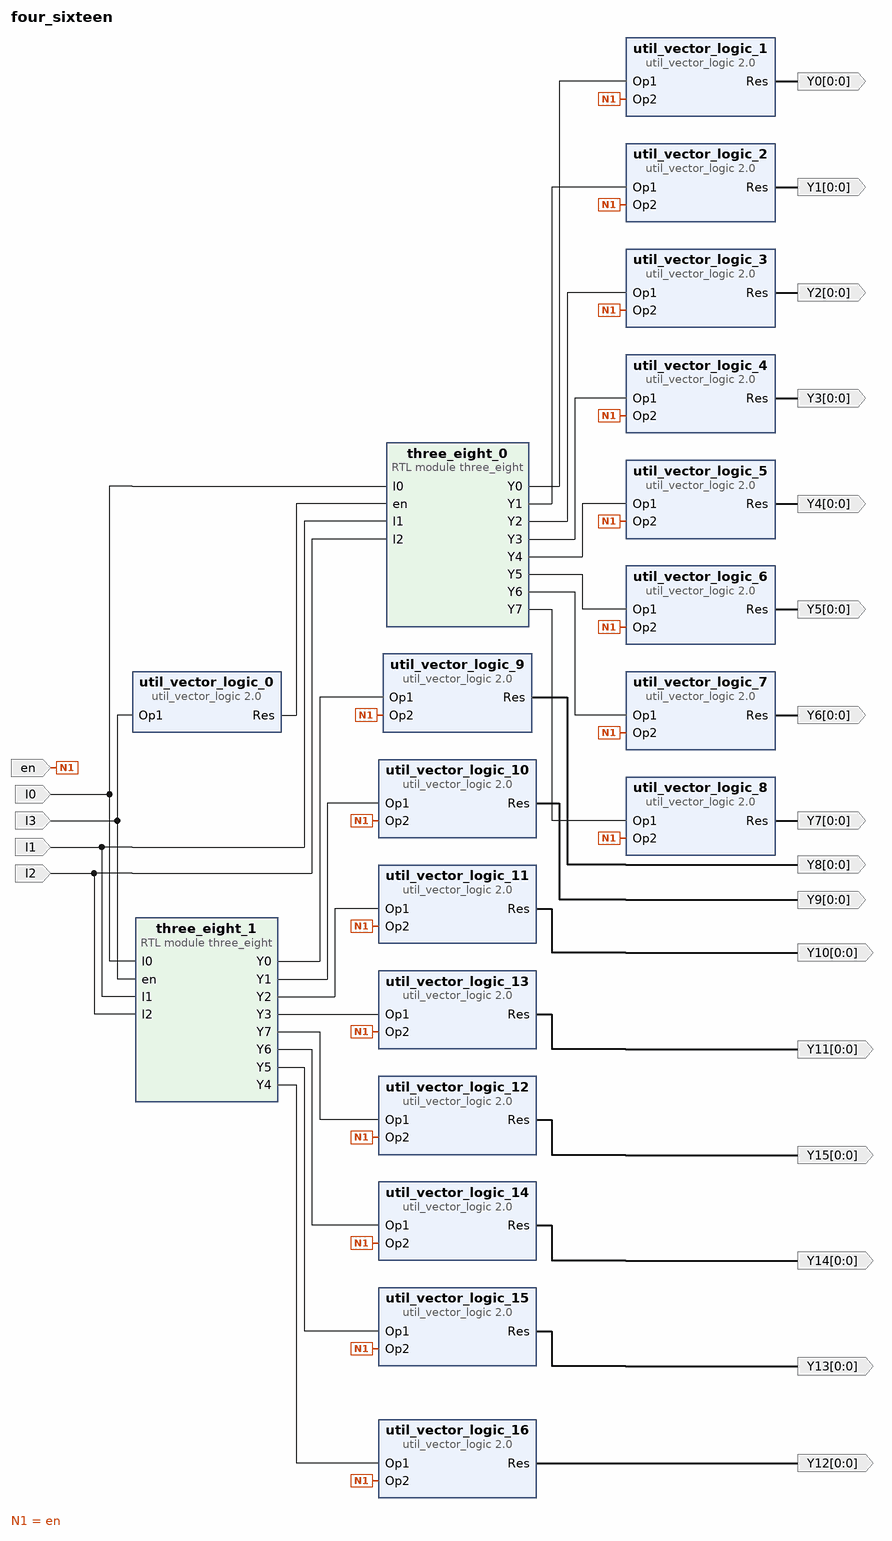
[diagram p0: block diagram of the top level]
# Vivado block design four_sixteen, xc7a100tfgg484-1, Vivado 2017.4
create_bd_design four_sixteen

create_bd_port -dir I -type data I0
create_bd_port -dir I -type data I1
create_bd_port -dir I I2
create_bd_port -dir I I3
create_bd_port -dir I en
create_bd_port -dir O -from 0 -to 0 Y0
create_bd_port -dir O -from 0 -to 0 Y1
create_bd_port -dir O -from 0 -to 0 Y2
create_bd_port -dir O -from 0 -to 0 Y3
create_bd_port -dir O -from 0 -to 0 Y4
create_bd_port -dir O -from 0 -to 0 Y5
create_bd_port -dir O -from 0 -to 0 Y6
create_bd_port -dir O -from 0 -to 0 Y7
create_bd_port -dir O -from 0 -to 0 Y8
create_bd_port -dir O -from 0 -to 0 Y9
create_bd_port -dir O -from 0 -to 0 Y10
create_bd_port -dir O -from 0 -to 0 Y11
create_bd_port -dir O -from 0 -to 0 Y12
create_bd_port -dir O -from 0 -to 0 Y13
create_bd_port -dir O -from 0 -to 0 Y14
create_bd_port -dir O -from 0 -to 0 Y15

create_bd_cell -type ip -vlnv xilinx.com:ip:util_vector_logic:2.0 util_vector_logic_0
set_property -dict {CONFIG.C_SIZE 1 CONFIG.C_OPERATION not} [get_bd_cells util_vector_logic_0]
create_bd_cell -type ip -vlnv xilinx.com:ip:util_vector_logic:2.0 util_vector_logic_1
set_property -dict {CONFIG.C_SIZE 1} [get_bd_cells util_vector_logic_1]
create_bd_cell -type ip -vlnv xilinx.com:ip:util_vector_logic:2.0 util_vector_logic_2
set_property -dict {CONFIG.C_SIZE 1} [get_bd_cells util_vector_logic_2]
create_bd_cell -type ip -vlnv xilinx.com:ip:util_vector_logic:2.0 util_vector_logic_3
set_property -dict {CONFIG.C_SIZE 1} [get_bd_cells util_vector_logic_3]
create_bd_cell -type ip -vlnv xilinx.com:ip:util_vector_logic:2.0 util_vector_logic_4
set_property -dict {CONFIG.C_SIZE 1} [get_bd_cells util_vector_logic_4]
create_bd_cell -type ip -vlnv xilinx.com:ip:util_vector_logic:2.0 util_vector_logic_5
set_property -dict {CONFIG.C_SIZE 1} [get_bd_cells util_vector_logic_5]
create_bd_cell -type ip -vlnv xilinx.com:ip:util_vector_logic:2.0 util_vector_logic_6
set_property -dict {CONFIG.C_SIZE 1} [get_bd_cells util_vector_logic_6]
create_bd_cell -type ip -vlnv xilinx.com:ip:util_vector_logic:2.0 util_vector_logic_7
set_property -dict {CONFIG.C_SIZE 1} [get_bd_cells util_vector_logic_7]
create_bd_cell -type ip -vlnv xilinx.com:ip:util_vector_logic:2.0 util_vector_logic_8
set_property -dict {CONFIG.C_SIZE 1} [get_bd_cells util_vector_logic_8]
create_bd_cell -type ip -vlnv xilinx.com:ip:util_vector_logic:2.0 util_vector_logic_9
set_property -dict {CONFIG.C_SIZE 1} [get_bd_cells util_vector_logic_9]
create_bd_cell -type ip -vlnv xilinx.com:ip:util_vector_logic:2.0 util_vector_logic_10
set_property -dict {CONFIG.C_SIZE 1} [get_bd_cells util_vector_logic_10]
create_bd_cell -type ip -vlnv xilinx.com:ip:util_vector_logic:2.0 util_vector_logic_11
set_property -dict {CONFIG.C_SIZE 1} [get_bd_cells util_vector_logic_11]
create_bd_cell -type ip -vlnv xilinx.com:ip:util_vector_logic:2.0 util_vector_logic_12
set_property -dict {CONFIG.C_SIZE 1} [get_bd_cells util_vector_logic_12]
create_bd_cell -type ip -vlnv xilinx.com:ip:util_vector_logic:2.0 util_vector_logic_13
set_property -dict {CONFIG.C_SIZE 1} [get_bd_cells util_vector_logic_13]
create_bd_cell -type ip -vlnv xilinx.com:ip:util_vector_logic:2.0 util_vector_logic_14
set_property -dict {CONFIG.C_SIZE 1} [get_bd_cells util_vector_logic_14]
create_bd_cell -type ip -vlnv xilinx.com:ip:util_vector_logic:2.0 util_vector_logic_15
set_property -dict {CONFIG.C_SIZE 1} [get_bd_cells util_vector_logic_15]
create_bd_cell -type ip -vlnv xilinx.com:ip:util_vector_logic:2.0 util_vector_logic_16
set_property -dict {CONFIG.C_SIZE 1} [get_bd_cells util_vector_logic_16]
create_bd_cell -type module -reference three_eight three_eight_0
create_bd_cell -type module -reference three_eight three_eight_1

# ---- connections ----

connect_bd_net -net I0_1 [get_bd_ports I0] [get_bd_pins three_eight_0/I0] [get_bd_pins three_eight_1/I0]
connect_bd_net -net I1_1 [get_bd_ports I1] [get_bd_pins three_eight_0/I1] [get_bd_pins three_eight_1/I1]
connect_bd_net -net I2_1 [get_bd_ports I2] [get_bd_pins three_eight_0/I2] [get_bd_pins three_eight_1/I2]
connect_bd_net [get_bd_pins util_vector_logic_0/Res] [get_bd_pins three_eight_0/en]
connect_bd_net -net I3_1 [get_bd_ports I3] [get_bd_pins util_vector_logic_0/Op1] [get_bd_pins three_eight_1/en]
connect_bd_net [get_bd_pins three_eight_0/Y0] [get_bd_pins util_vector_logic_1/Op1]
connect_bd_net [get_bd_pins three_eight_0/Y1] [get_bd_pins util_vector_logic_2/Op1]
connect_bd_net [get_bd_pins three_eight_0/Y2] [get_bd_pins util_vector_logic_3/Op1]
connect_bd_net [get_bd_pins three_eight_0/Y3] [get_bd_pins util_vector_logic_4/Op1]
connect_bd_net [get_bd_pins three_eight_0/Y4] [get_bd_pins util_vector_logic_5/Op1]
connect_bd_net [get_bd_pins three_eight_0/Y5] [get_bd_pins util_vector_logic_6/Op1]
connect_bd_net [get_bd_pins three_eight_0/Y6] [get_bd_pins util_vector_logic_7/Op1]
connect_bd_net [get_bd_pins three_eight_0/Y7] [get_bd_pins util_vector_logic_8/Op1]
connect_bd_net [get_bd_pins three_eight_1/Y0] [get_bd_pins util_vector_logic_9/Op1]
connect_bd_net [get_bd_pins three_eight_1/Y1] [get_bd_pins util_vector_logic_10/Op1]
connect_bd_net [get_bd_pins three_eight_1/Y2] [get_bd_pins util_vector_logic_11/Op1]
connect_bd_net [get_bd_pins three_eight_1/Y3] [get_bd_pins util_vector_logic_13/Op1]
connect_bd_net [get_bd_pins three_eight_1/Y4] [get_bd_pins util_vector_logic_16/Op1]
connect_bd_net [get_bd_pins three_eight_1/Y5] [get_bd_pins util_vector_logic_15/Op1]
connect_bd_net [get_bd_pins three_eight_1/Y6] [get_bd_pins util_vector_logic_14/Op1]
connect_bd_net [get_bd_pins three_eight_1/Y7] [get_bd_pins util_vector_logic_12/Op1]
connect_bd_net [get_bd_ports en] \
  [get_bd_pins util_vector_logic_1/Op2] [get_bd_pins util_vector_logic_2/Op2] [get_bd_pins util_vector_logic_3/Op2] \
  [get_bd_pins util_vector_logic_4/Op2] [get_bd_pins util_vector_logic_5/Op2] [get_bd_pins util_vector_logic_6/Op2] \
  [get_bd_pins util_vector_logic_7/Op2] [get_bd_pins util_vector_logic_8/Op2] [get_bd_pins util_vector_logic_9/Op2] \
  [get_bd_pins util_vector_logic_10/Op2] [get_bd_pins util_vector_logic_11/Op2] [get_bd_pins util_vector_logic_13/Op2] \
  [get_bd_pins util_vector_logic_16/Op2] [get_bd_pins util_vector_logic_15/Op2] [get_bd_pins util_vector_logic_14/Op2] \
  [get_bd_pins util_vector_logic_12/Op2]
connect_bd_net [get_bd_pins util_vector_logic_1/Res] [get_bd_ports Y0]
connect_bd_net [get_bd_pins util_vector_logic_2/Res] [get_bd_ports Y1]
connect_bd_net [get_bd_pins util_vector_logic_3/Res] [get_bd_ports Y2]
connect_bd_net [get_bd_pins util_vector_logic_4/Res] [get_bd_ports Y3]
connect_bd_net [get_bd_pins util_vector_logic_9/Res] [get_bd_ports Y8]
connect_bd_net [get_bd_pins util_vector_logic_8/Res] [get_bd_ports Y7]
connect_bd_net [get_bd_pins util_vector_logic_7/Res] [get_bd_ports Y6]
connect_bd_net [get_bd_pins util_vector_logic_6/Res] [get_bd_ports Y5]
connect_bd_net [get_bd_pins util_vector_logic_5/Res] [get_bd_ports Y4]
connect_bd_net [get_bd_pins util_vector_logic_10/Res] [get_bd_ports Y9]
connect_bd_net [get_bd_pins util_vector_logic_13/Res] [get_bd_ports Y11]
connect_bd_net [get_bd_pins util_vector_logic_11/Res] [get_bd_ports Y10]
connect_bd_net [get_bd_pins util_vector_logic_16/Res] [get_bd_ports Y12]
connect_bd_net [get_bd_pins util_vector_logic_15/Res] [get_bd_ports Y13]
connect_bd_net [get_bd_pins util_vector_logic_14/Res] [get_bd_ports Y14]
connect_bd_net [get_bd_pins util_vector_logic_12/Res] [get_bd_ports Y15]

validate_bd_design
save_bd_design
